# EAGLE design snowflake_insert (EAGLE 8.3.2)
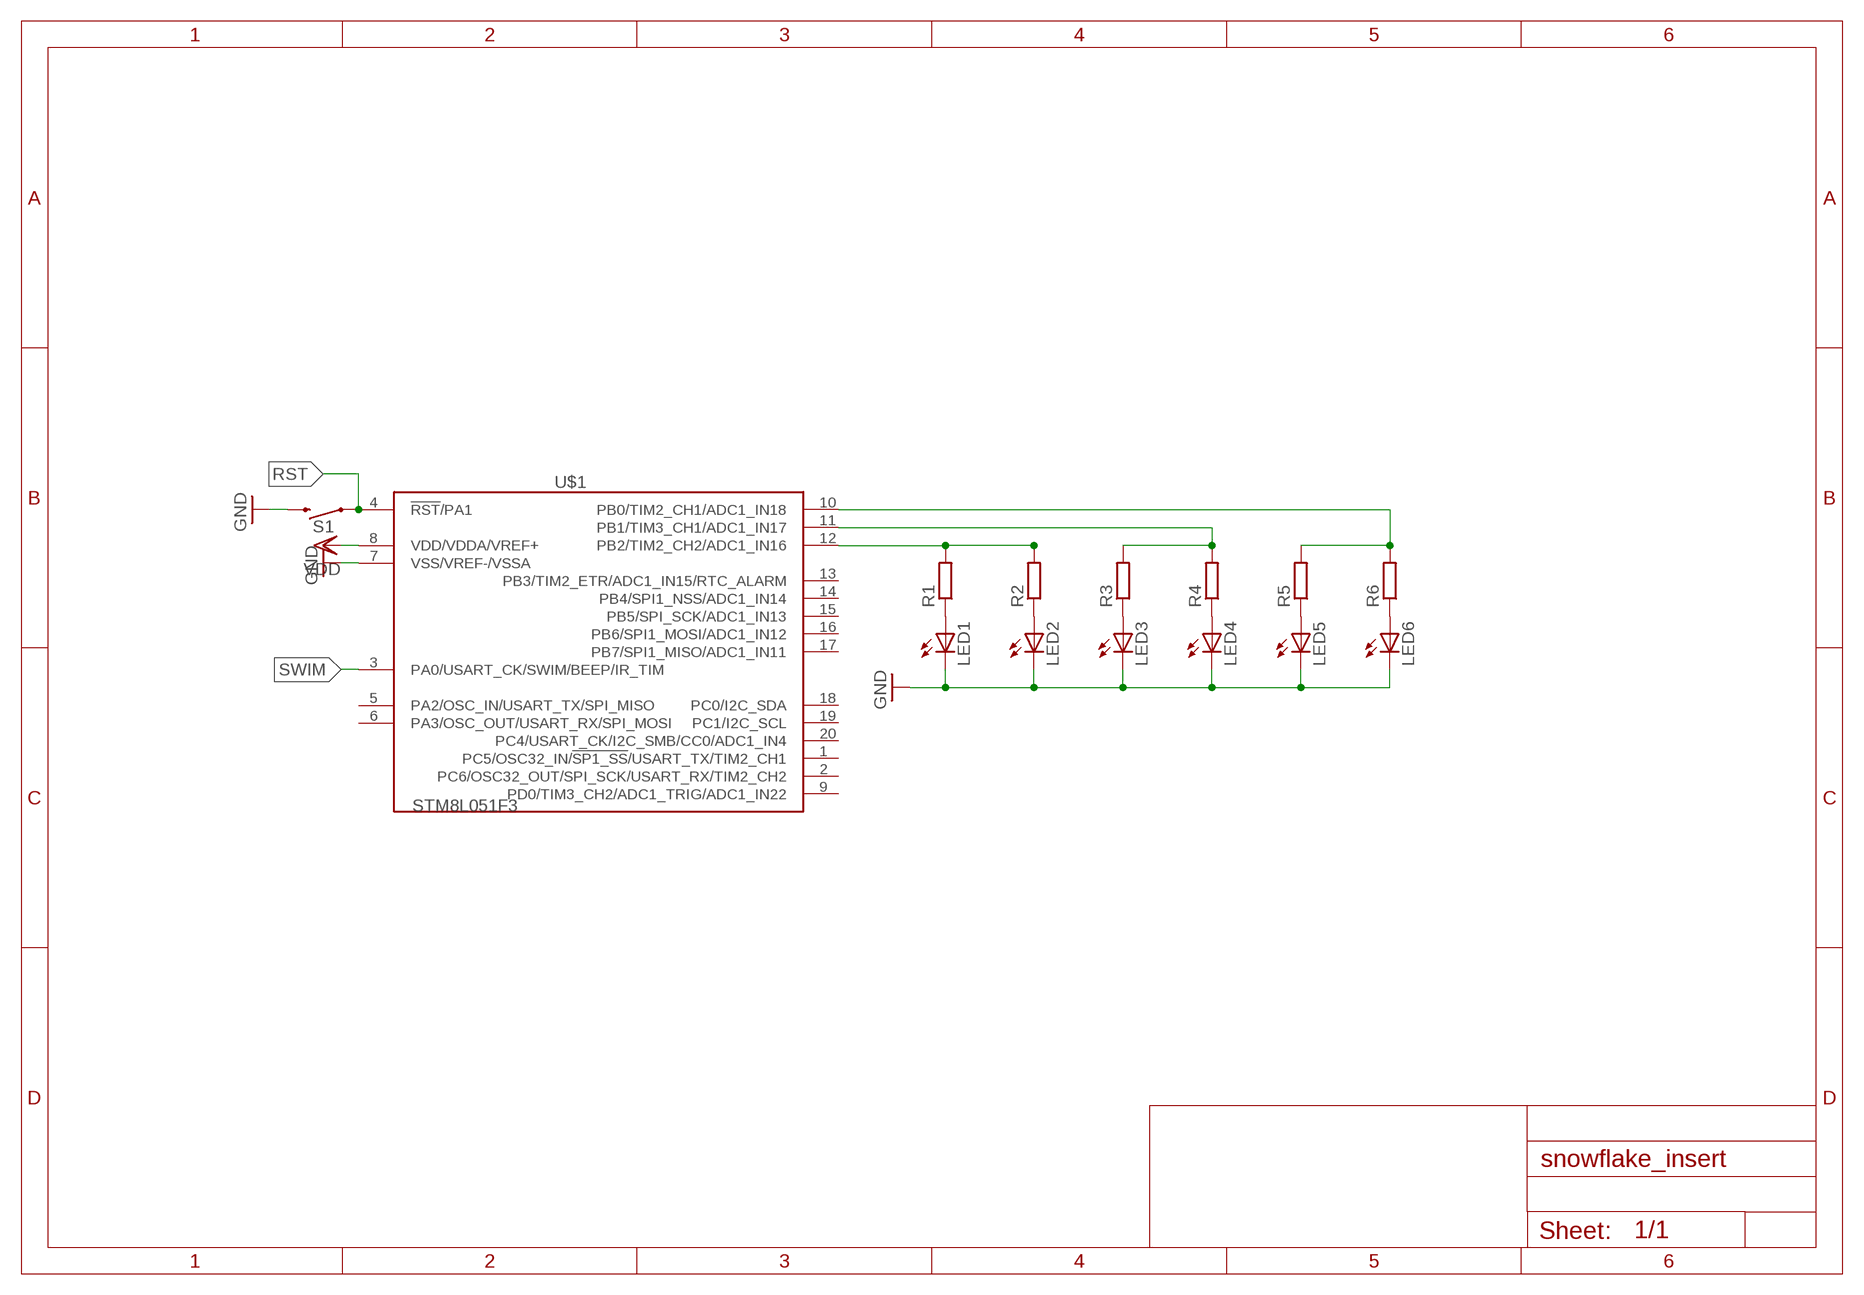
[diagram p0: schematic, sheet 1]

## Parts
LED1  LEDSML0805  [SML0805]
LED2  LEDSML0805  [SML0805]
LED3  LEDSML0805  [SML0805]
LED4  LEDSML0805  [SML0805]
LED5  LEDSML0805  [SML0805]
LED6  LEDSML0805  [SML0805]
R1  R-EU_R0603  [R0603]
R2  R-EU_R0603  [R0603]
R3  R-EU_R0402  [R0402]
R4  R-EU_R0603  [R0603]
R5  R-EU_R0603  [R0603]
R6  R-EU_R0603  [R0603]
S1  MOMENTARY-SWITCH-SPST-SMD-6.0X3.5MM  [TACTILE_SWITCH_SMD_6.0X3.5MM]
U$1  STM8L051F3  [TSSOP20]

## Nets
GND: LED1.C LED2.C LED3.C LED4.C LED5.C LED6.C S1.2 U$1.7(VSS/VREF-/VSSA)
N$1: LED1.A R1.1
N$2: LED2.A R2.1
N$3: LED3.A R3.1
N$4: LED4.A R4.1
N$5: LED5.A R5.1
N$6: LED6.A R6.1
N$8: R5.2 R6.2 U$1.10(PB0/TIM2_CH1/ADC1_IN18)
N$9: R3.2 R4.2 U$1.11(PB1/TIM3_CH1/ADC1_IN17)
N$10: R1.2 R2.2 U$1.12(PB2/TIM2_CH2/ADC1_IN16)
RST: S1.1 U$1.4(!RST!/PA1)
SWIM: U$1.3(PA0/USART_CK/SWIM/BEEP/IR_TIM)
VDD: U$1.8(VDD/VDDA/VREF+)
Unconnected: U$1.1(PC5/OSC32_IN/!SP1_SS!/USART_TX/TIM2_CH1) U$1.2(PC6/OSC32_OUT/SPI_SCK/USART_RX/TIM2_CH2) U$1.5(PA2/OSC_IN/USART_TX/SPI_MISO) U$1.6(PA3/OSC_OUT/USART_RX/SPI_MOSI) U$1.9(PD0/TIM3_CH2/ADC1_TRIG/ADC1_IN22) U$1.13(PB3/TIM2_ETR/ADC1_IN15/RTC_ALARM) U$1.14(PB4/SPI1_NSS/ADC1_IN14) U$1.15(PB5/SPI_SCK/ADC1_IN13) U$1.16(PB6/SPI1_MOSI/ADC1_IN12) U$1.17(PB7/SPI1_MISO/ADC1_IN11) U$1.18(PC0/I2C_SDA) U$1.19(PC1/I2C_SCL) U$1.20(PC4/USART_CK/I2C_SMB/CC0/ADC1_IN4)

## Library data of the parts
LED1-LED6 = led:LED: LED OSRAM: - CHIPLED LG R971, LG N971, LY N971, LG Q971, LY Q971, LO R971, LY R971 LH N974, LH R974 LS Q976, LO Q976, LY Q976 LO Q996 - Hyper CHIPLED LW Q18S LB Q993, LB Q99A, LB R99A - SideLED LS A670, LO A670, LY A670, LG A670, LP A670 LB A673, LV A673, LT A673, LW A673 LH A674 LY A675 LS A676, LA A676, LO A676, LY A676, LW A676 LS A679, LY A679, LG A679 - Hyper Micro SIDELED® LS Y876, LA Y876, LO Y876, LY Y876 LT Y87S - SmartLED LW L88C, LW L88S LB L89C, LB L89S, LG L890 LS L89K, LO L89K, LY L89K LS L896, LA L896, LO L896, LY L896 - TOPLED LS T670, LO T670, LY T670, LG T670, LP T670 LSG T670, LSP T670, LSY T670, LOP T670, LYG T670 LG T671, LOG T671, LSG T671 LB T673, LV T673, LT T673, LW T673 LH T674 LS T676, LA T676, LO T676, LY T676, LB T676, LH T676, LSB T676, LW T676 LB T67C, LV T67C, LT T67C, LS T67K, LO T67K, LY T67K, LW E67C LS E67B, LA E67B, LO E67B, LY E67B, LB E67C, LV E67C, LT E67C LW T67C LS T679, LY T679, LG T679 LS T770, LO T770, LY T770, LG T770, LP T770 LB T773, LV T773, LT T773, LW T773 LH T774 LS E675, LA E675, LY E675, LS T675 LS T776, LA T776, LO T776, LY T776, LB T776 LHGB T686 LT T68C, LB T68C - Hyper Mini TOPLED® LB M676 - Mini TOPLED Santana® LG M470 LS M47K, LO M47K, LY M47K Source: http://www.osram.convergy.de LUXEON: - LUMILED® LXK2-PW12-R00, LXK2-PW12-S00, LXK2-PW14-U00, LXK2-PW14-V00 LXK2-PM12-R00, LXK2-PM12-S00, LXK2-PM14-U00 LXK2-PE12-Q00, LXK2-PE12-R00, LXK2-PE12-S00, LXK2-PE14-T00, LXK2-PE14-U00 LXK2-PB12-K00, LXK2-PB12-L00, LXK2-PB12-M00, LXK2-PB14-N00, LXK2-PB14-P00, LXK2-PB14-Q00 LXK2-PR12-L00, LXK2-PR12-M00, LXK2-PR14-Q00, LXK2-PR14-R00 LXK2-PD12-Q00, LXK2-PD12-R00, LXK2-PD12-S00 LXK2-PH12-R00, LXK2-PH12-S00 LXK2-PL12-P00, LXK2-PL12-Q00, LXK2-PL12-R00 Source: www.luxeon.com KINGBRIGHT: KA-3528ASYC Source: www.kingbright.com
R1-R6 = rcl:R-EU_: RESISTOR, European symbol
S1 = SparkFun-Switches:MOMENTARY-SWITCH-SPST: Momentary Switch (Pushbutton) - SPST Normally-open (NO) SPST momentary switches (buttons, pushbuttons). Variants PTH-12MM - 12mm square, through-hole Momentary Pushbutton Switch - 12mm Square <https://www.sparkfun.com/products/9190> (COM-09190) PTH-6.0MM, PTH-6.0MM-KIT - 6.0mm square, through-hole Mini Pushbutton Switch <https://www.sparkfun.com/products/97> (COM-00097) KIT package intended for soldering kit's - only one side of pads' copper is exposed. PTH-RIGHT-ANGLE-KIT - Right-angle, through-hole Right Angle Tactile Button <https://www.sparkfun.com/products/10791> - Used on SparkFun BigTime Watch Kit <https://www.sparkfun.com/products/11734> SMD-12MM - 12mm square, surface-mount Tactile Button - SMD (12mm) <https://www.sparkfun.com/products/12993> (COM-12993) Used on SparkFun PicoBoard <https://www.sparkfun.com/products/11888> SMD-4.5MM - 4.5mm Square Trackball Switch Used on SparkFun Blackberry Trackballer Breakout <https://www.sparkfun.com/products/13169> SMD-4.6MMX2.8MM - 4.60mm x 2.80mm, surface mount Used on SparkFun SAMD21 Mini Breakout <https://www.sparkfun.com/products/13664> SMD-5.2MM, SMD-5.2-REDUNDANT - 5.2mm square, surface-mount Mini Pushbutton Switch - SMD <https://www.sparkfun.com/products/8720> (COM-08720) Used on Arduino Pro Mini <https://www.sparkfun.com/products/11114> REDUNDANT package connects both switch circuits together SMD-6.0X3.5MM - 6.0 x 3.5mm, surface mount Momentary Reset Switch SMD <https://www.sparkfun.com/products/8229> (COM-08229) SMD-6.2MM-TALL - 6.2mm square, surface mount Tactile Button - SMD (6mm) <https://www.sparkfun.com/products/12992> Used on SparkFun Digital Sandbox <https://www.sparkfun.com/products/12651> SMD-RIGHT-ANGLE - Right-angle, surface mount Used on SparkFun Block for Intel® Edison - Arduino <https://www.sparkfun.com/products/13036>; PROD_ID: SWCH-00815; SF_SKU: COM-08229
U$1 = stm8:STM8L051: Value Line, 8-bit ultralow power MCU, 8-KB Flash, 256-byte data EEPROM, RTC, timers, USART, I2C, SPI, ADC

## Board
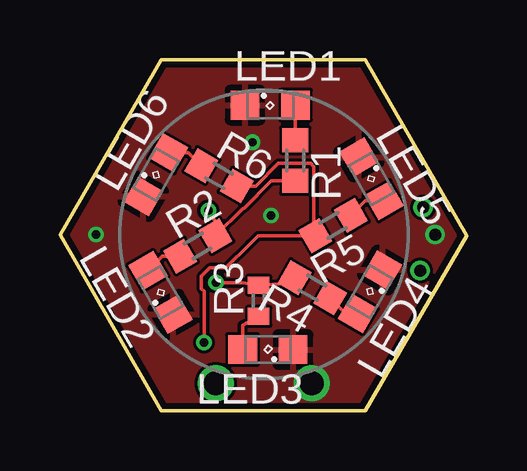
[diagram p1: board, top side]
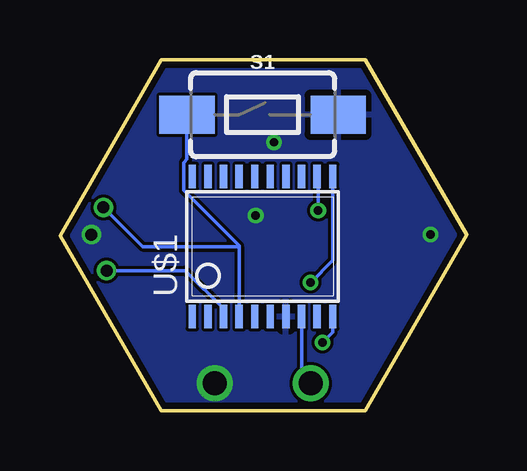
[diagram p2: board, bottom side, seen from below]

Size 16.94 x 14.61 mm. Coordinates in mm from the lower left corner, seen from the top.
Outline: 0,7.33 4.21,0 12.72,0 16.94,7.27 12.72,14.61 4.21,14.61 0,7.33
Copper layers (1*16): Top 0.035mm / dielectric 1.5mm / Bottom 0.035mm
Design rules "dirt_cheap_dirty_boards.v1": minimum track width 5mil, minimum drill 12mil, track to track 5mil, track to pad 5mil, pad to pad 5mil, via to via 5mil, smd to smd 0mil, copper to edge 10mil, drill to drill 10mil, minimum pad ring 10mil, minimum via ring 6mil, stop-mask expansion 2mil, vias tented up to drill 25mil, thermal gap 10mil

### Footprints (pad centres in the part's own frame; a part is rotated, then mirrored left to right if it is on the bottom)
SML0805 = smd 1.2 x 1.2: A 1.05,0; C -1.05,0
R0603 = smd 1 x 1.1: 1 -0.85,0; 2 0.85,0
R0402 = smd 0.7 x 0.9: 1 -0.65,0; 2 0.65,0
TACTILE_SWITCH_SMD_6.0X3.5MM = smd 2.3 x 1.6: 1 -3.15,0; 2 3.15,0
TSSOP20 = smd 0.305 x 0.991: 1 -2.925,-2.918; 2 -2.275,-2.918; 3 -1.625,-2.918; 4 -0.975,-2.918; 5 -0.325,-2.918; 6 0.325,-2.918; 7 0.975,-2.918; 8 1.625,-2.918; 9 2.275,-2.918; 10 2.925,-2.918; 11 2.925,2.918; 12 2.275,2.918; 13 1.625,2.918; 14 0.975,2.918; 15 0.325,2.918; 16 -0.325,2.918; 17 -0.975,2.918; 18 -1.625,2.918; 19 -2.275,2.918; 20 -2.925,2.918

### Placement (x,y rotation side)
LED1  8.76,12.72 0 top
LED2  4.19,4.92 120 top
LED3  8.66,2.54 180 top
LED4  12.92,4.95 240 top
LED5  12.98,9.65 300 top
LED6  4,9.83 60 top
R1  9.8,10.41 270 top
R2  5.74,6.86 30 top
R3  8.28,4.57 90 top
R4  10.51,5.11 150 top
R5  11.38,7.71 210 top
R6  6.63,9.78 330 top
S1  8.5,12.33 0 bottom
U$1  8.5,6.83 0 bottom

### Tracks (layer width: path | path; a pad name or v marks a point on that pad's centre or on a via)
GND  (via drill 0.35, 0.5, 1)
  other vias: 10.48,1.13 1.5,7.33 15.63,7.33 8.03,11.18 8.79,8.13
  pour Bottom: 3.5,15.33 13,15.33 18,7.33 13,-1.17 4,-1.17 -1,7.33
  pour Top: -1,7.33 3.5,15.33 13,15.33 18,7.33 13,-1.17 4,-1.17
N$1
  Top 0.152: LED1.A R1.1
N$2
  Top 0.152: LED2.A 4.26,6.43 R2.1
N$3
  Top 0.152: LED3.A 7.61,3.56 R3.1
N$4
  Top 0.152: R4.1 11.9,4.04 LED4.A
N$5
  Top 0.152: R5.1 12.73,8.74 LED5.A
N$6
  Top 0.152: R6.1 5.35,10.74 LED6.A
N$8  (via drill 0.35)
  Top 0.152: 10.56,7.28 R5.2 | v6,2.83 6,4.98 5.89,5.08 5.89,5.58 6.25,5.94 6.92,5.94 7.9,6.93 8,7.02 8.26,7.28 10.56,7.28 | R6.2 8.16,9.35 9.1,10.29 10.45,10.29 10.58,10.16 10.58,8.97 10.56,8.95 10.56,7.28
  Bottom 0.152: v6,2.83 5.58,3.26 U$1.10
N$9  (via drill 0.35)
  Top 0.152: R4.2 9.54,5.29 R3.2 7.61,5.33 v6.5,5.33
  Bottom 0.152: U$1.11 5.58,6.26 v6.5,5.33
N$10  (via drill 0.35)
  Top 0.152: v6.18,8.33 6.25,8.27 6.25,8.13 6.47,7.9 R2.2 7.61,8.41 7.67,8.43 8.8,9.56 R1.2
  Bottom 0.152: v6.18,8.33 6.18,9.71 U$1.12
RST  (via drill 0.5)
  Bottom 0.152: 9.47,4.24 U$1.4 9.47,6.83 | 9.47,6.83 9.47,6.87 11.78,9.17 11.78,10.33 11.65,10.46 S1.1 | v15.13,8.46 13.5,6.83 9.47,6.83
SWIM  (via drill 0.5)
  Bottom 0.152: v15,5.83 11.72,5.83 10.12,4.24 U$1.3
VDD  (via drill 1)
  Bottom 0.152: U$1.8 6.88,1.52 v6.48,1.13